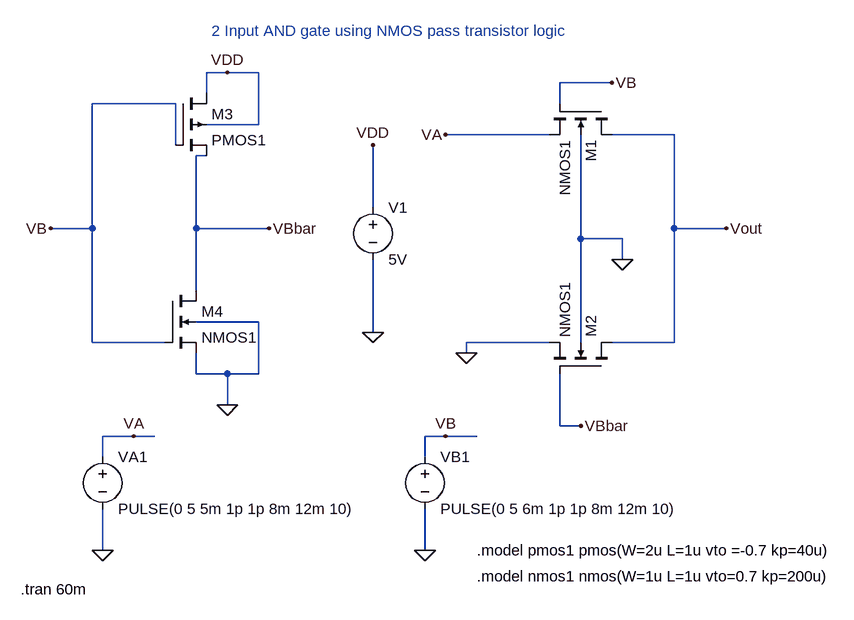
[diagram p0: schematic 2and plt.asc]
2and plt.asc, the LTspice schematic file:
Version 4
SHEET 1 928 764
WIRE -64 -48 -96 -48
WIRE -16 -48 -64 -48
WIRE 528 -32 448 -32
WIRE -96 -16 -96 -48
WIRE -144 0 -272 0
WIRE 448 0 448 -32
WIRE -16 32 -16 -48
WIRE -16 32 -96 32
WIRE 432 48 272 48
WIRE 624 48 528 48
WIRE -144 64 -144 0
WIRE -96 80 -112 80
WIRE 160 160 160 64
WIRE -272 192 -272 0
WIRE -272 192 -336 192
WIRE -112 192 -112 80
WIRE 0 192 -112 192
WIRE 624 192 624 48
WIRE 704 192 624 192
WIRE 480 208 480 48
WIRE 544 208 480 208
WIRE 544 240 544 208
WIRE -112 288 -112 192
WIRE -16 336 -112 336
WIRE 160 352 160 240
WIRE -272 368 -272 192
WIRE -160 368 -272 368
WIRE 432 368 304 368
WIRE 480 368 480 208
WIRE 624 368 624 192
WIRE 624 368 528 368
WIRE 304 384 304 368
WIRE -112 416 -112 384
WIRE -64 416 -112 416
WIRE -16 416 -16 336
WIRE -16 416 -64 416
WIRE -64 464 -64 416
WIRE 448 496 448 416
WIRE 480 496 448 496
WIRE -208 512 -256 512
WIRE -176 512 -208 512
WIRE 272 512 240 512
WIRE 320 512 272 512
WIRE -256 544 -256 512
WIRE 240 544 240 512
WIRE -256 688 -256 624
WIRE 240 688 240 624
FLAG -64 464 0
FLAG 304 384 0
FLAG 544 240 0
FLAG 240 688 0
FLAG -256 688 0
FLAG 160 352 0
FLAG -64 -48 VDD
FLAG 160 64 VDD
FLAG 272 512 VB
FLAG 528 -32 VB
FLAG -336 192 VB
FLAG 0 192 VBbar
FLAG 480 496 VBbar
FLAG 704 192 Vout
FLAG -208 512 VA
FLAG 272 48 VA
SYMBOL nmos4 -160 288 R0
SYMATTR InstName M4
SYMATTR Value NMOS1
SYMBOL nmos4 528 0 R90
SYMATTR InstName M1
SYMATTR Value NMOS1
SYMBOL pmos4 -144 -16 R0
SYMATTR InstName M3
SYMATTR Value PMOS1
SYMBOL nmos4 528 416 M270
SYMATTR InstName M2
SYMATTR Value NMOS1
SYMBOL voltage 160 144 R0
SYMATTR InstName V1
SYMATTR Value 5V
SYMBOL voltage -256 528 R0
WINDOW 123 0 0 Left 0
WINDOW 39 0 0 Left 0
SYMATTR InstName VA1
SYMATTR Value PULSE(0 5 5m 1p 1p 8m 12m 10)
SYMBOL voltage 240 528 R0
WINDOW 123 0 0 Left 0
WINDOW 39 0 0 Left 0
SYMATTR InstName VB1
SYMATTR Value PULSE(0 5 6m 1p 1p 8m 12m 10)
TEXT -88 -112 Left 2 ;2 Input AND gate using NMOS pass transistor logic
TEXT 320 688 Left 2 !.model pmos1 pmos(W=2u L=1u vto =-0.7 kp=40u)
TEXT 320 728 Left 2 !.model nmos1 nmos(W=1u L=1u vto=0.7 kp=200u)
TEXT -382 748 Left 2 !.tran 60m

The netlist it stands for:
* 2and plt.asc
M4 VBbar VB 0 0 NMOS1
M1 Vout VB VA 0 NMOS1
M3 VDD VB VBbar VDD PMOS1
M2 Vout VBbar 0 0 NMOS1
V1 VDD 0 5V
VA1 VA 0 PULSE(0 5 5m 1p 1p 8m 12m 10)
VB1 VB 0 PULSE(0 5 6m 1p 1p 8m 12m 10)
.model NMOS NMOS
.model PMOS PMOS
.lib standard.mos
* 2 Input AND gate using NMOS pass transistor logic
.model pmos1 pmos(W=2u L=1u vto =-0.7 kp=40u)
.model nmos1 nmos(W=1u L=1u vto=0.7 kp=200u)
.tran 60m
.backanno
.end